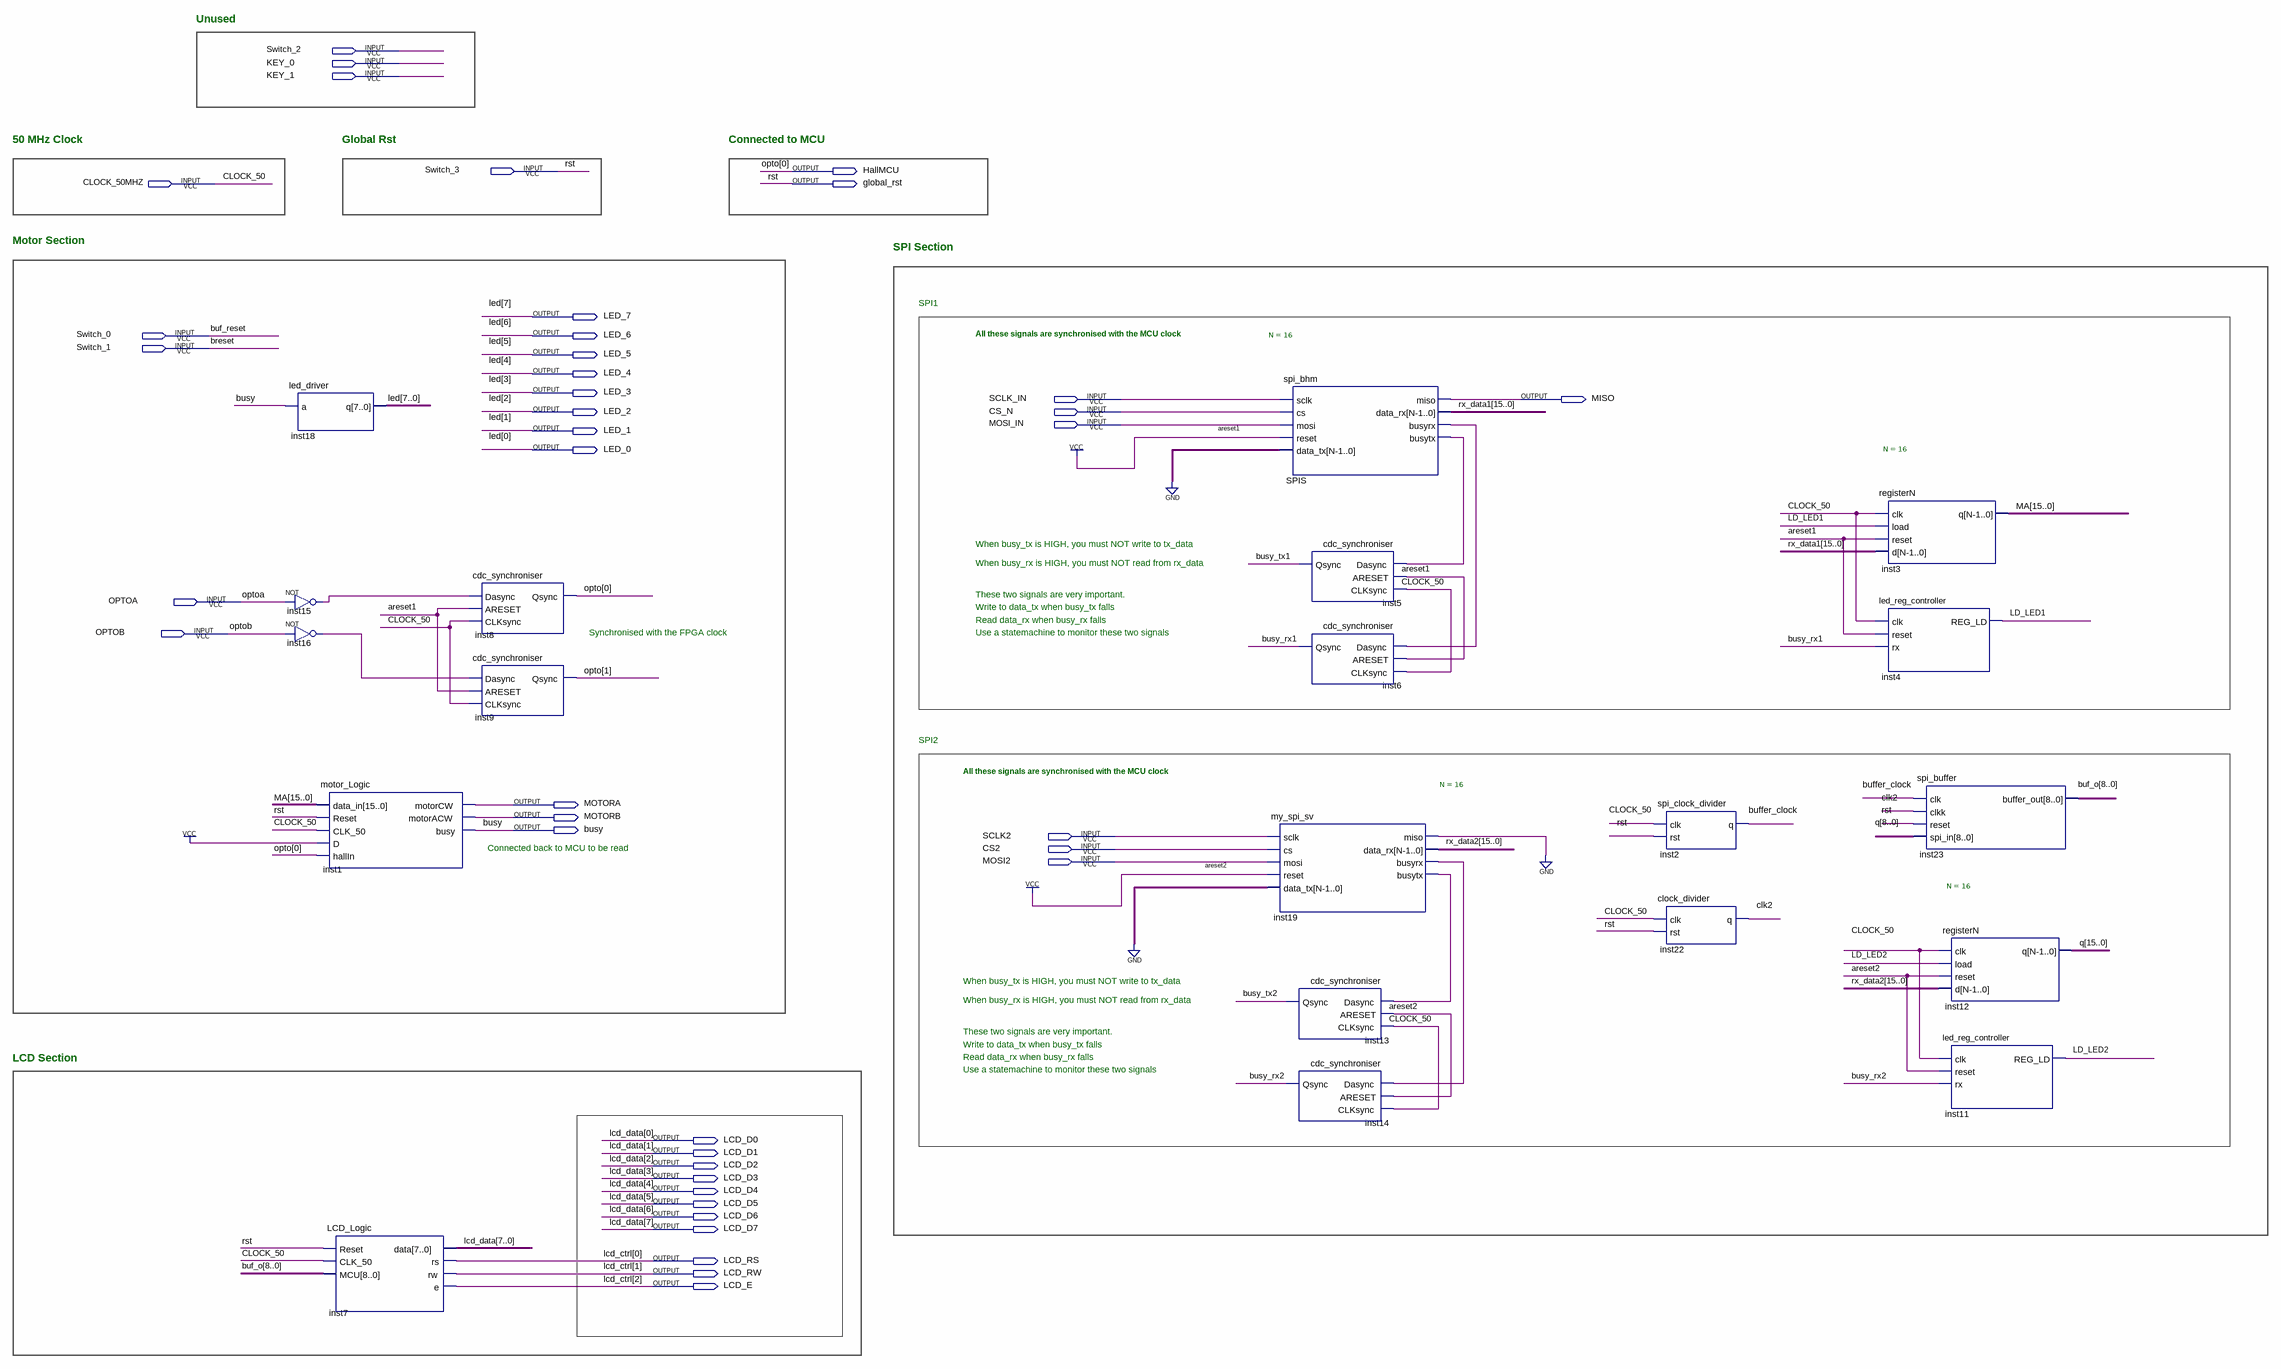
[diagram p0: schematic sheet]
// Quartus schematic spi_test.bdf as structural Verilog: 20 symbols, 40 pins
module spi_test (
  input  Switch_2,
  input  KEY_0,
  input  KEY_1,
  input  Switch_3,
  input  CLOCK_50MHZ,
  input  Switch_0,
  input  Switch_1,
  input  SCLK_IN,
  input  CS_N,
  input  MOSI_IN,
  input  OPTOA,
  input  OPTOB,
  input  SCLK2,
  input  CS2,
  input  MOSI2,
  output HallMCU,
  output global_rst,
  output LED_7,
  output LED_6,
  output LED_5,
  output LED_4,
  output LED_3,
  output MISO,
  output LED_2,
  output LED_1,
  output LED_0,
  output MOTORA,
  output MOTORB,
  output busy,
  output LCD_D0,
  output LCD_D1,
  output LCD_D2,
  output LCD_D3,
  output LCD_D4,
  output LCD_D5,
  output LCD_D6,
  output LCD_D7,
  output LCD_RS,
  output LCD_RW,
  output LCD_E
);

  wire buffer_clock, busy_rx1, busy_rx2, busy_tx1, busy_tx2, clk2, inst15_out, inst16_out, inst19_busyrx,
       inst19_busytx, inst19_miso, LD_LED1, LD_LED2, SPIS_busyrx, SPIS_busytx;
  wire [1:1] opto;
  wire [8:0] buf_o;
  wire [15:0] MA, q, rx_data1, rx_data2;

  led_driver inst18 (.a(busy), .q({LED_7, LED_6, LED_5, LED_4, LED_3, LED_2, LED_1, LED_0}));
  not inst15 (inst15_out, OPTOA);
  not inst16 (inst16_out, OPTOB);
  motor_Logic inst1 (
    .data_in(MA), .Reset(Switch_3), .CLK_50(CLOCK_50MHZ), .D(1'b1), .hallIn(HallMCU), .motorCW(MOTORA),
    .motorACW(MOTORB), .busy(busy));
  LCD_Logic inst7 (
    .Reset(Switch_3), .CLK_50(CLOCK_50MHZ), .MCU(buf_o),
    .data({LCD_D7, LCD_D6, LCD_D5, LCD_D4, LCD_D3, LCD_D2, LCD_D1, LCD_D0}), .rs(LCD_RS), .rw(LCD_RW),
    .e(LCD_E));
  cdc_synchroniser inst8 (.Dasync(inst15_out), .ARESET(1'b1), .CLKsync(CLOCK_50MHZ), .Qsync(HallMCU));
  cdc_synchroniser inst9 (.Dasync(inst16_out), .ARESET(1'b1), .CLKsync(CLOCK_50MHZ), .Qsync(opto[1]));
  spi_bhm #(.N(16)) SPIS (
    .sclk(SCLK_IN), .cs(CS_N), .mosi(MOSI_IN), .reset(1'b1), .data_tx({16{1'b0}}), .miso(MISO),
    .data_rx(rx_data1), .busyrx(SPIS_busyrx), .busytx(SPIS_busytx));
  my_spi_sv #(.N(16)) inst19 (
    .sclk(SCLK2), .cs(CS2), .mosi(MOSI2), .reset(1'b1), .data_tx({16{1'b0}}), .miso(inst19_miso),
    .data_rx(rx_data2), .busyrx(inst19_busyrx), .busytx(inst19_busytx));
  cdc_synchroniser inst5 (.Dasync(SPIS_busytx), .ARESET(1'b1), .CLKsync(CLOCK_50MHZ), .Qsync(busy_tx1));
  cdc_synchroniser inst6 (.Dasync(SPIS_busyrx), .ARESET(1'b1), .CLKsync(CLOCK_50MHZ), .Qsync(busy_rx1));
  cdc_synchroniser inst13 (.Dasync(inst19_busytx), .ARESET(1'b1), .CLKsync(CLOCK_50MHZ), .Qsync(busy_tx2));
  cdc_synchroniser inst14 (.Dasync(inst19_busyrx), .ARESET(1'b1), .CLKsync(CLOCK_50MHZ), .Qsync(busy_rx2));
  spi_clock_divider inst2 (.clk(CLOCK_50MHZ), .rst(Switch_3), .q(buffer_clock));
  clock_divider inst22 (.clk(CLOCK_50MHZ), .rst(Switch_3), .q(clk2));
  registerN #(.N(16)) inst3 (.clk(CLOCK_50MHZ), .load(LD_LED1), .reset(1'b1), .d(rx_data1), .q(MA));
  led_reg_controller inst4 (.clk(CLOCK_50MHZ), .reset(1'b1), .rx(busy_rx1), .REG_LD(LD_LED1));
  spi_buffer inst23 (.clk(buffer_clock), .clkk(clk2), .reset(Switch_3), .spi_in(q[8:0]), .buffer_out(buf_o));
  registerN #(.N(16)) inst12 (.clk(CLOCK_50MHZ), .load(LD_LED2), .reset(1'b1), .d(rx_data2), .q(q));
  led_reg_controller inst11 (.clk(CLOCK_50MHZ), .reset(1'b1), .rx(busy_rx2), .REG_LD(LD_LED2));

  assign global_rst = Switch_3;
  // also tied to GND on the sheet: inst19_miso

  // Other names for the same wires on the sheet: breset = Switch_1; buf_reset = Switch_0; CLOCK_50 = CLOCK_50MHZ;
  //   lcd_ctrl[2:0] = {LCD_E, LCD_RW, LCD_RS};
  //   lcd_data[7:0] = {LCD_D7, LCD_D6, LCD_D5, LCD_D4, LCD_D3, LCD_D2, LCD_D1, LCD_D0};
  //   led[7:0] = {LED_7, LED_6, LED_5, LED_4, LED_3, LED_2, LED_1, LED_0}; opto[0] = HallMCU; rst = Switch_3

  // Notes on the sheet:
  //   Unused
  //   50 MHz Clock
  //   Global Rst
  //   Connected to MCU
  //   Motor Section
  //   SPI Section
  //   SPI1
  //   All these signals are synchronised with the MCU clock
  //   When busy_tx is HIGH, you must NOT write to tx_data
  //   When busy_rx is HIGH, you must NOT read from rx_data
  //   These two signals are very important.
  //   Write to data_tx when busy_tx falls
  //   Read data_rx when busy_rx falls
  //   Synchronised with the FPGA clock
  //   Use a statemachine to monitor these two signals
  //   SPI2
  //   All these signals are synchronised with the MCU clock
  //   Connected back to MCU to be read
  //   When busy_tx is HIGH, you must NOT write to tx_data
  //   When busy_rx is HIGH, you must NOT read from rx_data
  //   These two signals are very important.
  //   Write to data_tx when busy_tx falls
  //   LCD Section
  //   Read data_rx when busy_rx falls
  //   Use a statemachine to monitor these two signals
endmodule
